# EAGLE design PCB (EAGLE 9.6.2)

## Sheet 1 of 2
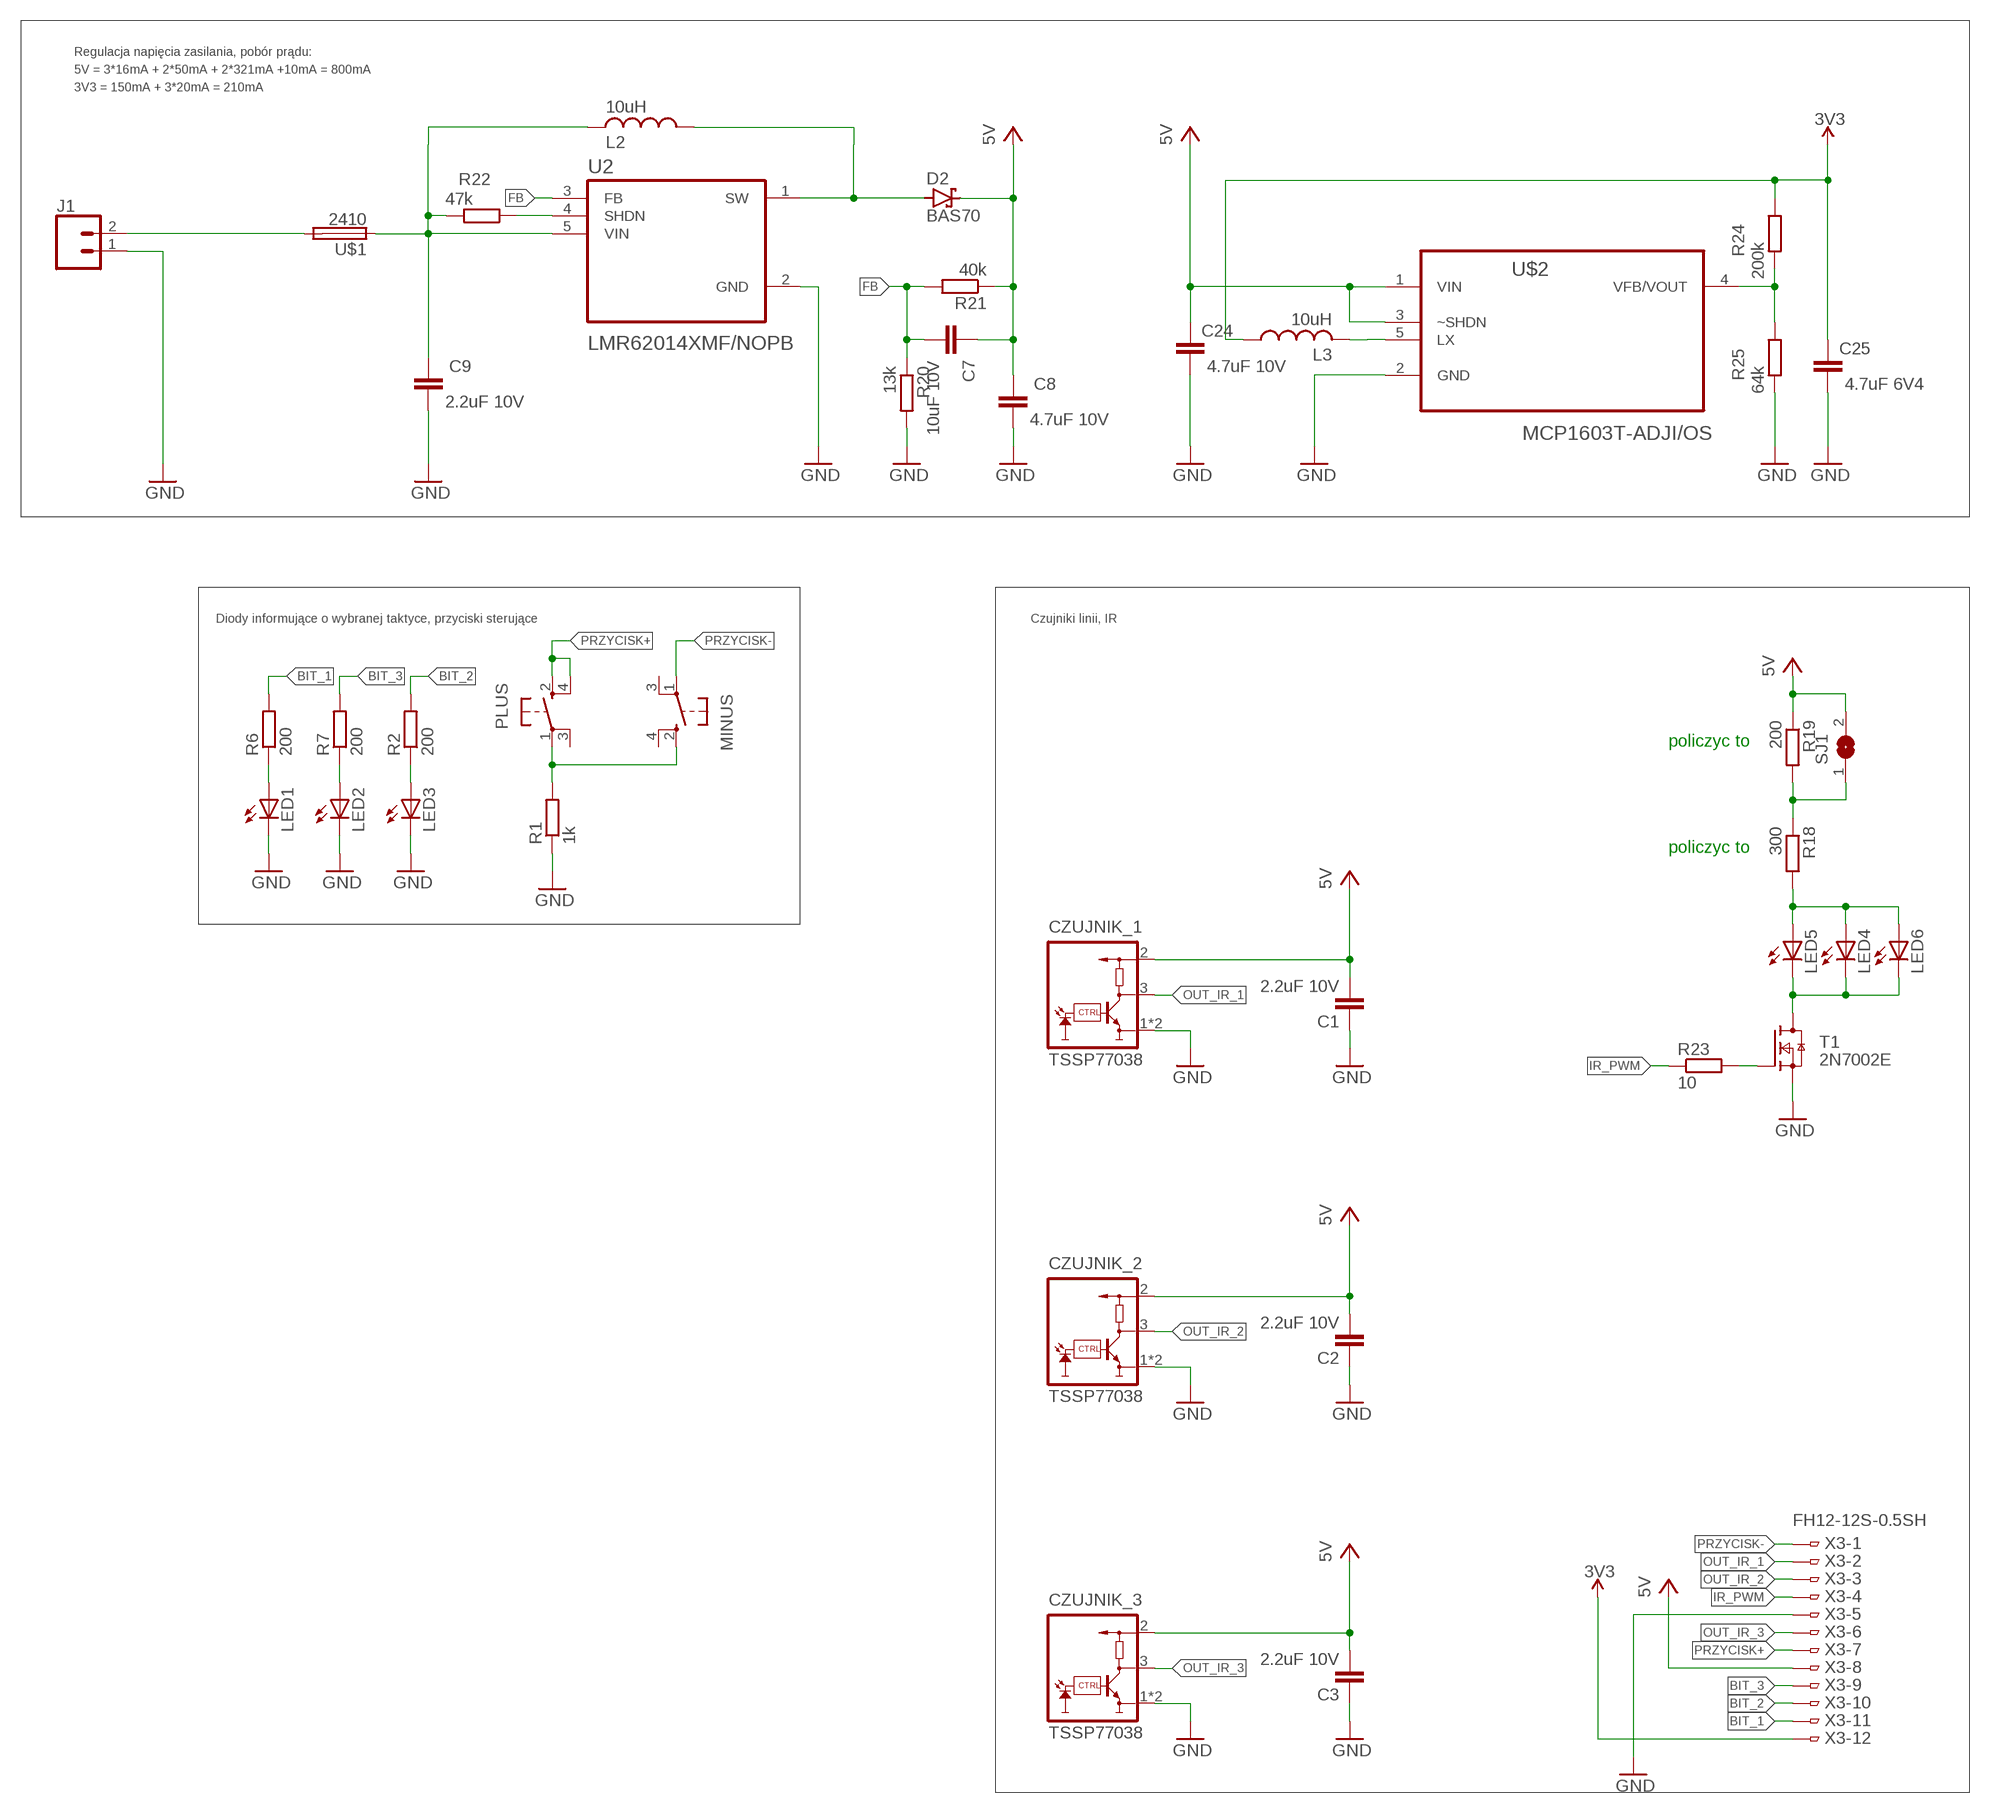
[diagram p0: schematic, sheet 1]

### Parts
C1  2.2uF 10V  C-EUC0402  [C0402]
C2  2.2uF 10V  C-EUC0402  [C0402]
C3  2.2uF 10V  C-EUC0402  [C0402]
C7  10uF 10V  C-EUC0402  [C0402]
C8  4.7uF 10V  C-EUC0402  [C0402]
C9  2.2uF 10V  C-EUC0402  [C0402]
C24  4.7uF 10V  C-EUC0402  [C0402]
C25  4.7uF 6V4  C-EUC0402  [C0402]
CZUJNIK_1  TSSP77038  [TSSP77038]
CZUJNIK_2  TSSP77038  [TSSP77038]
CZUJNIK_3  TSSP77038  [TSSP77038]
D2  BAS70  [SOT23]
J1  CONN_02POLAR_LOCK  [MOLEX-1X2_LOCK]
L2  10uH  DJNR5020  [DJNR5020]
L3  10uH  L-USL1812  [L1812]
LED1  LEDCHIP-LED0603  [CHIP-LED0603]
LED2  LEDCHIP-LED0603  [CHIP-LED0603]
LED3  LEDCHIP-LED0603  [CHIP-LED0603]
LED4  LED3MM  [LED3MM]
LED5  LED3MM  [LED3MM]
LED6  LED3MM  [LED3MM]
MINUS  SPST_TACT-KMR2  [KMR2]
PLUS  SPST_TACT-KMR2  [KMR2]
R1  1k  R-EU_R0402  [R0402]
R2  200  R-EU_R0805  [R0805]
R6  200  R-EU_R0805  [R0805]
R7  200  R-EU_R0805  [R0805]
R18  300  R-EU_R0402  [R0402]
R19  200  R-EU_R0402  [R0402]
R20  13k  R-EU_R0402  [R0402]
R21  40k  R-EU_R0402  [R0402]
R22  47k  R-EU_R0402  [R0402]
R23  10  R-EU_R0402  [R0402]
R24  200k  R-EU_R0402  [R0402]
R25  64k  R-EU_R0402  [R0402]
SJ1  SJ  [SJ]
T1  2N7002E  [SOT23]
U2  LMR62014XMF/NOPB  [SOT95P280X145-5N]
U$1  2410  [2410]
U$2  MCP1603T-ADJI/OS  [SOT95P280X110-5N]
X3  FH12-12S-0.5SH  [FH12-12S-0.5SH]

### Nets
3.3V: C25.2 L3.1 R24.1 X3.12 ; supply symbol labelled 3V3
BIT_1: R6.2 X3.11
BIT_2: R2.2 X3.10
BIT_3: R7.2 X3.9
FB: C7.1 R20.1 R21.2 U2.3(FB)
GND: C1.1 C2.1 C3.1 C8.1 C9.1 C24.1 C25.1 CZUJNIK_1.1(GND) CZUJNIK_1.4(GND) CZUJNIK_2.1(GND) CZUJNIK_2.4(GND) CZUJNIK_3.1(GND) CZUJNIK_3.4(GND) J1.1 LED1.C LED2.C LED3.C R1.1 R20.2 R25.2 T1.2(S) U2.2(GND) U$2.2(GND) X3.5
IR_PWM: R23.1 X3.4
N$2: MINUS.2(S) PLUS.1(P) R1.2
N$3: LED2.A R7.1
N$4: LED3.A R2.1
N$5: LED1.A R6.1
N$6: C1.2 CZUJNIK_1.2(VS) ; supply symbol labelled 5V
N$7: C3.2 CZUJNIK_3.2(VS) ; supply symbol labelled 5V
N$9: C2.2 CZUJNIK_2.2(VS) ; supply symbol labelled 5V
N$10: LED4.K(C) LED5.K(C) LED6.K(C) T1.3(D)
N$11: D2.1(A) L2.P$1 U2.1(SW)
N$15: R18.1 R19.2 SJ1.1
N$16: LED4.A LED5.A LED6.A R18.2
N$17: R22.1 U2.4(SHDN)
N$20: J1.2 U$1.2
N$24: C9.2 L2.P$2 R22.2 U2.5(VIN) U$1.1
N$35: R23.2 T1.1(G)
N$36: L3.2 U$2.5(LX)
N$37: R24.2 R25.1 U$2.4(VFB/VOUT)
OUT_IR_1: CZUJNIK_1.3(OUT) X3.2
OUT_IR_2: CZUJNIK_2.3(OUT) X3.3
OUT_IR_3: CZUJNIK_3.3(OUT) X3.6
PRZYCISK+: PLUS.2(S) PLUS.4(S1) X3.7
PRZYCISK-: MINUS.1(P) X3.1
VCC: C7.2 C8.2 C24.2 D2.3(C) R19.1 R21.1 SJ1.2 U$2.1(VIN) U$2.3(~SHDN) X3.8 ; supply symbol labelled 5V
Unconnected: MINUS.3(P1) MINUS.4(S1) PLUS.3(P1)

### Notes on the sheet
- Regulacja napięcia zasilania, pobór prądu:
- 5V = 3*16mA + 2*50mA + 2*321mA +10mA = 800mA
- 3V3 = 150mA + 3*20mA = 210mA
- Diody informujące o wybranej taktyce, przyciski sterujące | Czujniki linii, IR
- policzyc to
- policzyc to

## Sheet 2 of 2

## Library data of the parts
C1-C3 C7-C9 C24 C25 = rcl:C-EU: CAPACITOR, European symbol; SPICEPREFIX: C
CZUJNIK_1-CZUJNIK_3 = TSSP77038:TSSP77038
D2 = diode:BAS70: Silicon Schottky Diodes General-purpose diode for high-speed switching
J1 = SparkFun-Connectors:CONN_02: Multi connection point. Often used as Generic Header-pin footprint for 0.1 inch spaced/style header connections On any of the 0.1 inch spaced packages, you can populate with these: Break Away Headers - Straight <https://www.sparkfun.com/products/116> (PRT-00116) Break Away Male Headers - Right Angle <https://www.sparkfun.com/products/553> (PRT-00553) Female Headers <https://www.sparkfun.com/products/115> (PRT-00115) Break Away Headers - Machine Pin <https://www.sparkfun.com/products/117> (PRT-00117) Break Away Female Headers - Swiss Machine Pin <https://www.sparkfun.com/products/743> (PRT-00743) For SCREWTERMINALS and SPRING TERMINALS visit here: Screw Terimnals on SparkFun.com <https://www.sparkfun.com/search/results?term=Screw+Terminals> (5mm/3.5mm/2.54mm spacing) This device is also useful as a general connection point to wire up your design to another part of your project. Our various solder wires solder well into these plated through hole pads. Hook-Up Wire - Assortment (Stranded, 22 AWG) <https://www.sparkfun.com/products/11375> (PRT-11375) Hook-Up Wire - Assortment (Solid Core, 22 AWG) <https://www.sparkfun.com/products/11367> (PRT-11367) View the entire wire category on our website here <https://www.sparkfun.com/categories/141> Special notes: Molex polarized connector foot print use with: PRT-08233 with associated crimp pins and housings. 2.54_SCREWTERM for use with PRT-10571. 3.5mm Screw Terminal footprints for PRT-08084 5mm Screw Terminal footprints for use with PRT-08432; SF_ID: PRT-09918
L2 = DJNR5020:DJNR5020
L3 = rcl:L-US: INDUCTOR, American symbol; SPICEPREFIX: L
LED1-LED6 = adafruit:LED: LED OSRAM: - CHIPLED LG R971, LG N971, LY N971, LG Q971, LY Q971, LO R971, LY R971 LH N974, LH R974 LS Q976, LO Q976, LY Q976 LO Q996 - Hyper CHIPLED LW Q18S LB Q993, LB Q99A, LB R99A - SideLED LS A670, LO A670, LY A670, LG A670, LP A670 LB A673, LV A673, LT A673, LW A673 LH A674 LY A675 LS A676, LA A676, LO A676, LY A676, LW A676 LS A679, LY A679, LG A679 - Hyper Micro SIDELED® LS Y876, LA Y876, LO Y876, LY Y876 LT Y87S - SmartLED LW L88C, LW L88S LB L89C, LB L89S, LG L890 LS L89K, LO L89K, LY L89K LS L896, LA L896, LO L896, LY L896 - TOPLED LS T670, LO T670, LY T670, LG T670, LP T670 LSG T670, LSP T670, LSY T670, LOP T670, LYG T670 LG T671, LOG T671, LSG T671 LB T673, LV T673, LT T673, LW T673 LH T674 LS T676, LA T676, LO T676, LY T676, LB T676, LH T676, LSB T676, LW T676 LB T67C, LV T67C, LT T67C, LS T67K, LO T67K, LY T67K, LW E67C LS E67B, LA E67B, LO E67B, LY E67B, LB E67C, LV E67C, LT E67C LW T67C LS T679, LY T679, LG T679 LS T770, LO T770, LY T770, LG T770, LP T770 LB T773, LV T773, LT T773, LW T773 LH T774 LS E675, LA E675, LY E675, LS T675 LS T776, LA T776, LO T776, LY T776, LB T776 LHGB T686 LT T68C, LB T68C - Hyper Mini TOPLED® LB M676 - Mini TOPLED Santana® LG M470 LS M47K, LO M47K, LY M47K Source: http://www.osram.convergy.de/
MINUS PLUS = adafruit:SPST_TACT: SMT 6mm switch, EVQQ2 series http://www.ladyada.net/library/eagle
R1 R2 R6 R7 R18-R25 = rcl:R-EU_: RESISTOR, European symbol; SPICEPREFIX: R
SJ1 = jumper:SJ: SMD solder JUMPER
T1 = NXP_60_26022015:2N7002: N-channel TrenchMOS FET N-channel enhancement mode Field-Effect Transistor (FET) in a plastic package using TrenchMOS technology. AAL Eindhoven MK
U2 = LMR62014XMF_NOPB:LMR62014XMF/NOPB: Check availability <https://pricing.snapeda.com/parts/LMR62014XMF/NOPB/Texas%20Instruments/view-part?ref=eda>; AVAILABILITY: In Stock; DESCRIPTION: SIMPLE SWITCHER&reg; 2.7V to 14V, 1.4A Step-Up Regulator in SOT-23 Package; MF: Texas Instruments; MP: LMR62014XMF/NOPB; PACKAGE: SOT-23-5 Texas Instruments; PRICE: None; PURCHASE-URL: https://pricing.snapeda.com/search/part/LMR62014XMF/NOPB/?ref=eda
U$1 = fuse:2410
U$2 = MCP1603T-ADJI_OS:MCP1603T-ADJI/OS: 2.0 MHz, 500 mA Synchronous Buck Regulator Check availability <https://pricing.snapeda.com/parts/MCP1603T-ADJI/OS/Microchip/view-part?ref=eda>; AVAILABILITY: In Stock; DESCRIPTION: Buck Switching Regulator IC Positive Adjustable 0.8V 1 Output 500mA SOT-23-5 Thin, TSOT-23-5; MF: Microchip; MP: MCP1603T-ADJI/OS; PACKAGE: TSOT-23 Microchip; PRICE: None; PURCHASE-URL: https://pricing.snapeda.com/search/part/MCP1603T-ADJI/OS/?ref=eda
X3 = con-hirose:FH12-12S-0.5S: 0.5mm Pitch Connectors For FPC/FFC Source: Data sheet <http://www.hirose.co.jp/cataloge_hp/e58605370.pdf>; MPN: FH12-12S-0.5SH(55); OC_FARNELL: 1324542; OC_NEWARK: 34M6155

## Board
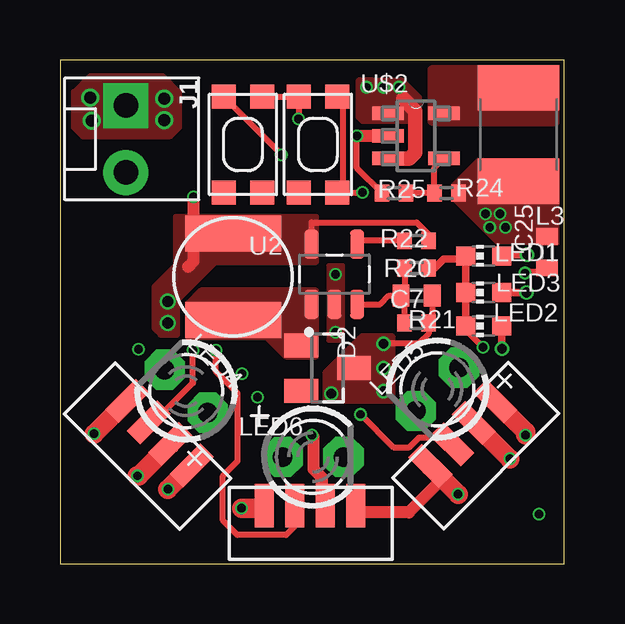
[diagram p1: board, top side]
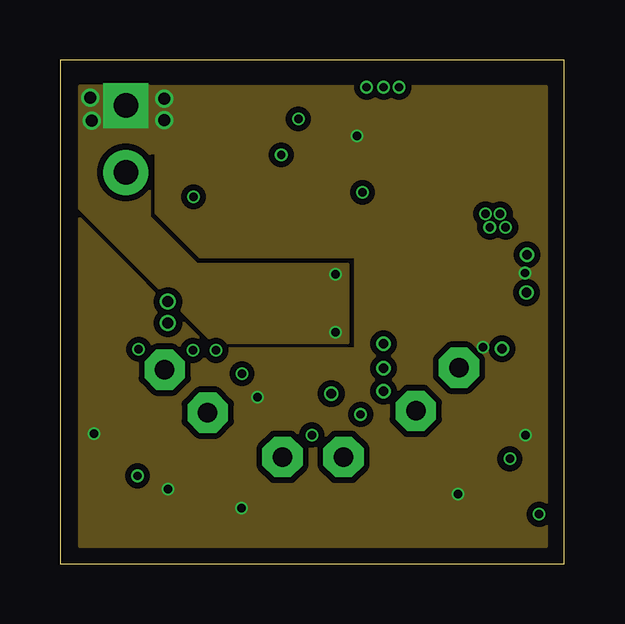
[diagram p2: board, inner layer Route2]
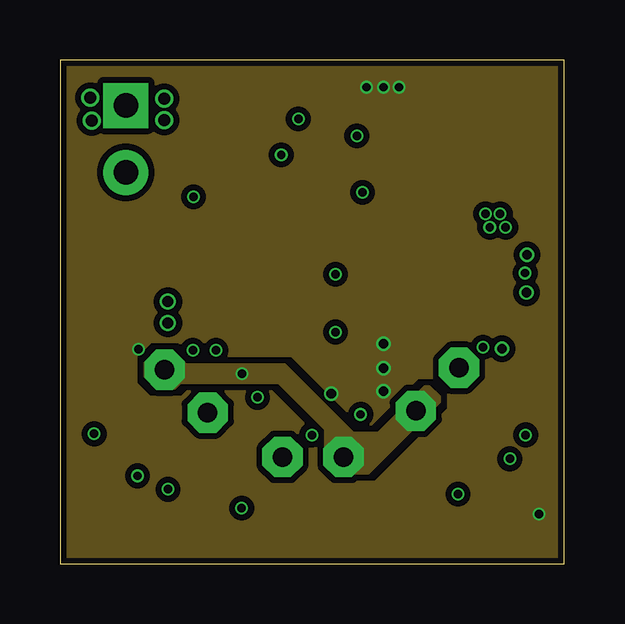
[diagram p3: board, inner layer Route15]
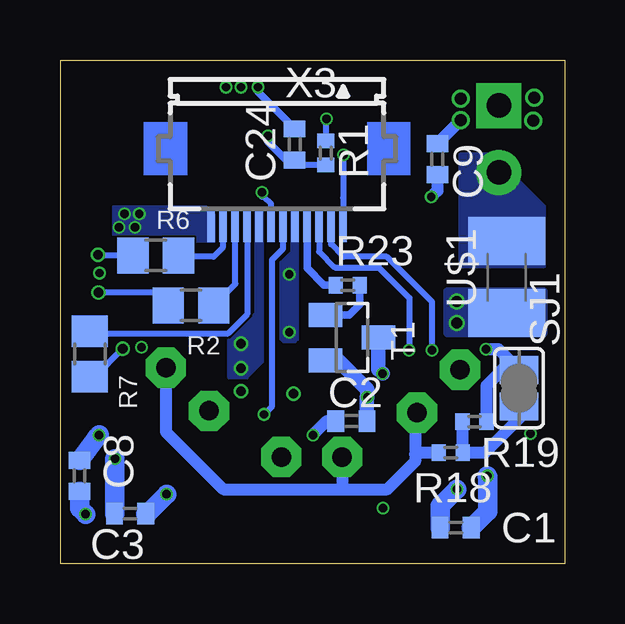
[diagram p4: board, bottom side, seen from below]

Size 21 x 21 mm. Coordinates in mm from the lower left corner, seen from the top.
Outline: 0,0 21,0 21,21 0,21 0,0
Copper layers (1*2+15*16): Top 0.035mm / dielectric 0.5mm / Route2 0.035mm / dielectric 0.46mm / Route15 0.035mm / dielectric 0.5mm / Bottom 0.035mm
Design rules "JLC4L": minimum track width 3.5mil, minimum drill 0.2mm, track to track 3.5mil, track to pad 5mil, pad to pad 5mil, via to via 5mil, smd to smd 5mil, copper to edge 0.2mm, drill to drill 5mil, minimum pad ring 3mil, minimum via ring 3mil, stop-mask expansion 2mil, vias tented up to drill 0.6mm, thermal gap 5mil

### Footprints (pad centres in the part's own frame; a part is rotated, then mirrored left to right if it is on the bottom)
C0402 = smd 0.7 x 0.9: 1 -0.65,0; 2 0.65,0
TSSP77038 = smd 0.8 x 1.8: 1 1.524,0.762; 2 2.794,0.762; 3 4.064,0.762; 4 5.334,0.762
SOT23 = smd 1 x 1.4: 1 -0.95,-1.1; 2 0.95,-1.1; 3 0,1.1
MOLEX-1X2_LOCK = drill 1.016 pad 1.88 square: 1 -0.127,0 | drill 1.016 pad 1.88: 2 2.667,0
DJNR5020 = smd 1.5 x 4: P$1 1.8,0; P$2 -1.8,0
L1812 = smd 1.9 x 3.4: 1 -1.95,0; 2 1.95,0
CHIP-LED0603 = smd 0.8 x 0.8: A 0,-0.75; C 0,0.75
LED3MM = drill 0.813 pad 1.676 octagon: A -1.27,0; K 1.27,0
KMR2 = smd 1 x 1: 1 2,0.8; 2 2,-0.8; 3 -2,0.8; 4 -2,-0.8
R0402 = smd 0.6 x 0.7: 1 -0.5,0; 2 0.5,0
R0805 = smd 1.3 x 1.5: 1 -0.95,0; 2 0.95,0
SJ = smd 1.168 x 1.6: 1 -0.762,0; 2 0.762,0
SOT95P280X145-5N = smd 1.21 x 0.59: 1 -1.255,0.95; 2 -1.255,0; 3 -1.255,-0.95; 4 1.255,-0.95; 5 1.255,0.95
2410 = smd 2 x 3.2: 1 -1.5,0; 2 1.5,0
SOT95P280X110-5N = smd 1.321 x 0.559: 1 -1.168,0.94; 2 -1.168,0; 3 -1.168,-0.94; 4 1.168,-0.94; 5 1.168,0.94
FH12-12S-0.5SH = smd 0.3 x 1.3: 1 -2.75,3.25; 2 -2.25,3.25; 3 -1.75,3.25; 4 -1.25,3.25; 5 -0.75,3.25; 6 -0.25,3.25; 7 0.25,3.25; 8 0.75,3.25; 9 1.25,3.25; 10 1.75,3.25; 11 2.25,3.25; 12 2.75,3.25

### Placement (x,y rotation side)
C1  4.55,1.5 0 bottom
C2  8.89,5.94 180 bottom
C3  18.11,2.08 180 bottom
C7  14.86,11.18 0 top
C8  20.22,3.66 270 bottom
C9  5.31,16.87 270 bottom
C24  11.25,17.48 90 bottom
C25  20.29,12.98 90 top
CZUJNIK_1  7.11,3.56 135 top
CZUJNIK_2  13.84,3.17 180 top
CZUJNIK_3  18.67,8.38 225 top
D2  11.15,8.15 270 top
J1  2.74,18.97 270 top
L2  7.21,11.96 270 top
L3  19.1,17.88 90 top
LED1  17.65,12.83 90 top
LED2  17.65,9.91 90 top
LED3  17.65,11.3 90 top
LED4  5.26,7.19 135 top
LED5  15.72,7.26 225 top
LED6  10.54,4.45 0 top
MINUS  7.62,17.48 90 top
PLUS  10.74,17.48 90 top
R1  9.96,17.12 90 bottom
R2  15.57,10.77 0 bottom
R6  17.04,12.85 0 bottom
R7  19.79,8.74 90 bottom
R18  4.75,4.62 180 bottom
R19  3.76,5.92 180 bottom
R20  14.86,12.32 0 top
R21  14.86,10.03 180 top
R22  14.86,13.46 0 top
R23  9.04,11.61 0 bottom
R24  16.1,15.44 180 top
R25  13.92,15.44 180 top
SJ1  1.91,7.32 90 bottom
T1  8.86,9.42 270 bottom
U2  11.43,12.06 90 top
U$1  2.41,11.94 90 bottom
U$2  14.83,17.83 0 top
X3  11.99,17.3 180 bottom

### Tracks (layer width: path | path; a pad name or v marks a point on that pad's centre or on a via)
3.3V  (via drill 0.35)
  other vias: 18.57,14.02 17.91,14.02 18.34,14.58 17.73,14.58
  pour Bottom (no thermals): 14.61,13.44 14.61,14.55 14.94,14.88 18.82,14.88 18.82,13.72 15.82,13.72 15.54,13.44
  pour Top (no thermals): 17.4,16.84 20.78,16.84 20.78,13.36 18.19,13.36 16.36,15.19 16.36,15.8
BIT_1
  Bottom 0.254: X3.11 14.23,14.04 14.23,13.2 14.63,12.8 16.04,12.8 R6.2
BIT_2
  Bottom 0.254: X3.10 13.72,14.03 13.72,11.66 R2.2
BIT_3
  Bottom 0.254: X3.9 13.24,10.39 14.03,9.6 19.7,9.6 R7.2
FB
  Top 0.254: C7.1 14.36,11.03 R21.2 | C7.1 14.36,11.33 R20.1 | U2.3 13.34,10.81 13.7,11.18 C7.1
GND  (via drill 0.35, 0.5)
  Top 0.254: R25.2 12.37,16.49 v12.37,17.83 | C25.1 20.13,12.17 19.43,12.17 v19.38,12.12 | LED2.C 16.9,9.74 v17.63,9.02
  Top 0.305: LED2.C LED3.C 16.9,12.04 LED1.C | LED1.C 16.78,12.7 15.99,12.7 15.61,12.32 R20.2 | LED1.C 17.03,12.95
  Top 0.508: U$2.2 v12.37,17.83 | CZUJNIK_3.4 15.87,3.64 15.87,3.46 14.54,2.13 12.6,2.13 CZUJNIK_2.1
  Top 0.813: CZUJNIK_1.4 v1.42,5.41 | CZUJNIK_1.1 v4.5,3.1 | CZUJNIK_2.4 8.41,2.31 v7.57,2.31 | v16.59,2.9 15.44,4.05 CZUJNIK_3.4 | CZUJNIK_3.1 19.4,5.49 v19.4,5.36
  Bottom 0.254: R1.1 11.25,16.62 C24.1
  Bottom 0.305: C24.1 11.61,16.82 12.37,17.59 v12.37,17.83
  Bottom 0.508: C9.1 v4.34,18.48 v4.34,18.49
  Bottom 0.61: T1.2 9.44,8.47 8.23,7.26 v8.23,6.93 v8.24,6.93 C2.1
  Bottom 0.813: v4.5,3.1 5.2,2.4 C1.1 | C3.1 17.4,2.08 v16.59,2.9 | C8.1 19.5,5.26 v19.4,5.36
  other vias: 1.27,19.43 1.32,18.47 4.34,19.38 11.48,12.06 11.48,9.65
  pour Top (no thermals): 0.58,19.66 1.24,20.32 4.29,20.32 4.95,19.66 4.95,18.19 4.57,17.81 0.97,17.81 0.58,18.19
  pour Top (no thermals): 11.18,9.27 11.18,12.45 11.81,12.45 11.81,9.27
  pour Bottom (no thermals): 11.13,14.76 11.38,14.76 11.38,13.03 11.84,12.57 11.84,9.35 11.73,9.25 11.23,9.25 11.13,9.35
  pour Route2 (isolate 0.254, no thermals): 11.99,9.22 6.4,9.22 0.81,14.81 0.81,19.91 3.71,19.91 3.71,14.45 5.69,12.47 11.99,12.47
  pour Route2 (isolate 0.254, no thermals): 2.11,19.89 20.27,19.89 20.27,0.71 0.81,0.71 0.81,14.38 6.25,8.94 12.32,8.94 12.32,12.8 5.82,12.8 4.01,14.61 4.01,17.14 2.11,17.14
IR_PWM
  Bottom 0.305: X3.4 10.74,12.31 10.03,11.61 R23.1
N$2  (via drill 0.35)
  Top 0.254: v9.93,18.54 9.94,18.55 PLUS.1 MINUS.2
  Bottom 0.254: R1.2 9.93,17.64 v9.93,18.54
N$3  (via drill 0.4)
  Top 0.305: LED2.A 18.41,9.89 v18.41,8.97
  Bottom 0.254: R7.1 19.59,7.79 v18.41,8.97
N$4  (via drill 0.4)
  Top 0.305: LED3.A v19.43,11.3
  Bottom 0.254: R2.1 17.05,11.3 v19.43,11.3
N$5  (via drill 0.4)
  Top 0.305: v19.45,12.88 18.45,12.88 LED1.A
  Bottom 0.254: R6.1 19.43,12.85 v19.45,12.88
N$6  (via drill 0.35)
  Top 0.813: CZUJNIK_1.2 3.28,3.66 v3.23,3.66
  Bottom 0.813: v3.23,3.66 3.23,3.64 3.21,3.62 3.21,2.75 3.21,2.18 C1.2
N$7  (via drill 0.35)
  Top 0.813: CZUJNIK_3.2 17.25,5.87 v18.75,4.37
  Bottom 0.813: C3.2 18.76,4.35 v18.75,4.37
N$9  (via drill 0.35)
  Top 0.508: CZUJNIK_2.2 10.92,2.54 10.92,3.57 10.57,3.93 10.57,5.29 v10.49,5.36
  Bottom 0.508: v10.49,5.36 9.91,5.94 C2.2
N$10  (via drill 0.35)
  Bottom 0.61: T1.3 7.76,8.1 v7.59,7.92
  pour Route15 (no thermals): 4.06,8.86 3.56,8.36 3.56,7.8 4.04,7.32 4.78,7.32 5,7.54 9.12,7.54 11.07,5.59 11.07,4.22 11.51,3.78 12.85,3.78 15.8,6.73 15.8,6.96 15.39,7.37 15.19,7.37 13.26,5.44 12.22,5.44 9.37,8.28 5.23,8.28 4.65,8.86
N$11
  pour Top (no thermals): 10.67,11.38 5.87,11.38 5.33,10.85 5.33,9.45 8.59,9.45 9.4,8.64 10.67,8.64
N$15
  Bottom 0.508: R19.2 R18.1 3.33,4.62 1.91,6.05 SJ1.1
N$16
  Bottom 0.508: LED5.A 16.62,5.5 14.22,3.1 9.22,3.1 | 9.22,3.1 7.39,3.1 6.23,4.26 6.23,4.57 | LED6.A 9.27,3.15 9.22,3.1 | LED4.A 6.23,6.21 6.23,4.57 | R18.2 6.18,4.62 6.23,4.57
N$17
  Top 0.254: R22.1 12.52,13.46 U2.4
N$20
  pour Bottom (no thermals): 4.32,12.45 0.89,12.45 0.89,14.86 3.05,17.02 4.32,17.02
N$24  (via drill 0.35, 0.45)
  Top 0.254: U2.5 10.48,14.22 14.86,14.22 15.36,13.72 R22.2
  Top 0.508: v5.56,15.29 5.56,12.6 5.33,12.37
  Bottom 0.508: v5.56,15.29 5.31,15.54 C9.2
  other vias: 4.5,10.03 4.5,10.92
  pour Top (no thermals): 4.83,12.57 10.67,12.57 10.67,14.45 4.83,14.45
  pour Bottom (no thermals): 0.84,11.38 4.93,11.38 4.93,9.58 0.84,9.58
  pour Top (no thermals): 3.94,11.53 3.94,9.8 4.19,9.55 4.88,9.55 4.88,11 7.98,14.1 6.5,14.1
N$35
  Bottom 0.305: T1.1 8.98,10.37 8.54,10.81 R23.2
N$36
  pour Top (no thermals): 15.54,18.49 20.62,18.49 20.62,20.55 15.54,20.55
N$37
  Top 0.254: U$2.4 15.6,16.49 R24.2 R25.1
OUT_IR_1  (via drill 0.35)
  Top 0.254: CZUJNIK_1.3 3.88,5.89 4.27,6.28 4.29,6.28 5.54,7.53 v5.54,8.89
  Bottom 0.254: v5.54,8.89 5.54,10.92 7.42,12.8 9.22,12.8 9.74,13.32 X3.2
OUT_IR_2  (via drill 0.35)
  Top 0.254: CZUJNIK_2.3 9.78,1.55 9.42,1.19 7.39,1.19 6.78,1.8 6.78,3.66 7.39,4.27 7.39,7.11 6.5,8 v6.5,8.89
  Bottom 0.254: X3.3 10.24,13.01 9.58,12.34 7.75,12.34 6.48,11.07 6.48,8.91 v6.5,8.89
OUT_IR_3  (via drill 0.35)
  Top 0.254: CZUJNIK_3.3 16.05,5.26 14.96,5.26 14.55,4.85 13.89,4.85 v12.53,6.22
  Bottom 0.254: X3.6 11.73,13.13 12.19,12.68 12.19,6.55 v12.53,6.22
PRZYCISK+  (via drill 0.35)
  Top 0.254: PLUS.4 11.79,15.47 | 11.79,15.47 v12.61,15.47 v12.61,15.48 | PLUS.2 11.79,19.23 11.79,15.47
  Bottom 0.254: X3.7 12.24,15.01 12.52,15.29 12.61,15.29 v12.61,15.48
PRZYCISK-  (via drill 0.35)
  Top 0.254: v9.22,17.04 9.22,17.07 MINUS.1
  Bottom 0.254: v9.22,17.04 9.24,17.02 9.24,15.24 X3.1
VCC  (via drill 0.35, 0.4)
  Top 0.254: C7.2 15.51,10.18 R21.1 | R21.1 15.36,9.59 14.94,9.17 v13.49,9.17
  Top 0.305: 12.36,8.04 D2.3 | C7.2 15.38,11.05 | 15.38,10.06 R21.1
  Top 0.61: U$2.3 14.55,16.89 14.81,17.14 14.81,18.87 14.3,19.38
  Bottom 0.305: C24.2 12.78,19.65 v12.78,19.86
  Bottom 0.508: R19.1 3.26,7.43 2.61,8.08 SJ1.2 2.77,8.94 v3.28,8.94
  Bottom 0.813: C8.2 20.22,2.31 v19.96,2.06
  other vias: 11.3,7.09 13.49,8.15 13.49,7.19 14.12,19.86 13.49,19.86
  pour Top (no thermals): 11.1,6.83 13.82,6.83 13.82,9.45 12.6,9.45 11.1,7.95
  pour Top (no thermals): 12.47,20.12 14.25,20.12 14.94,19.43 14.94,18.85 14.58,18.49 12.62,18.49 12.47,18.64
  pour Bottom (no thermals): 12.57,14.73 12.88,14.73 12.88,10.46 14.02,9.32 14.02,7.77 14,7.75 13.23,7.75 12.57,8.41
  pour Route15 (isolate 0.254, rank 2, no thermals): -0.28,21.59 -0.28,-1.27 22.86,-1.27 22.86,21.59